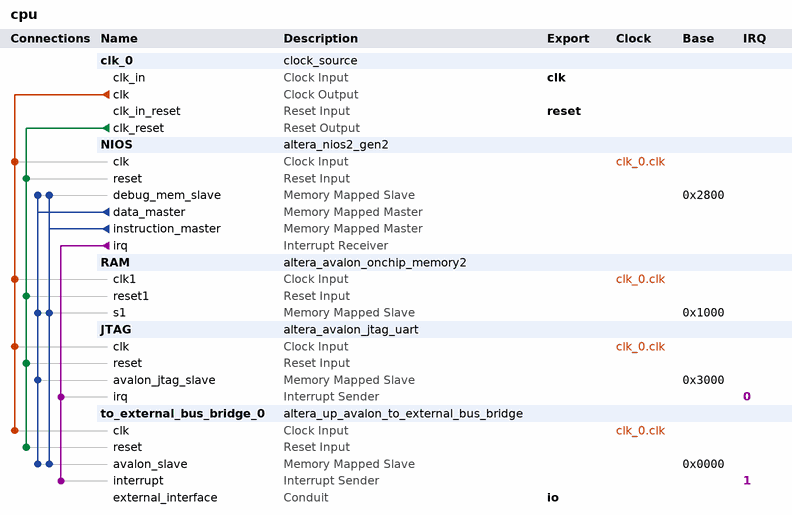
[diagram p0: system contents]
# Platform Designer (Qsys) system cpu, Cyclone V 5CSEMA5F31C6
# Parameters at their usual value, and those the tool derives, are not listed.
package require -exact qsys 18.1
create_system cpu
set_project_property DEVICE_FAMILY {Cyclone V}
set_project_property DEVICE 5CSEMA5F31C6

add_instance clk_0 clock_source 18.1
set_instance_parameter_value clk_0 clockFrequency 50000000

add_instance NIOS altera_nios2_gen2 18.1
set_instance_parameter_value NIOS dcache_size 2048
set_instance_parameter_value NIOS exceptionSlave RAM.s1
set_instance_parameter_value NIOS icache_size 4096
set_instance_parameter_value NIOS impl Fast
set_instance_parameter_value NIOS resetSlave RAM.s1

add_instance RAM altera_avalon_onchip_memory2 18.1
set_instance_parameter_value RAM dataWidth 32
set_instance_parameter_value RAM dualPort false
set_instance_parameter_value RAM initMemContent true
set_instance_parameter_value RAM initializationFileName onchip_mem.hex
set_instance_parameter_value RAM memorySize 4096

add_instance JTAG altera_avalon_jtag_uart 18.1
set_instance_parameter_value JTAG simInteractiveOptions NO_INTERACTIVE_WINDOWS

add_instance to_external_bus_bridge_0 altera_up_avalon_to_external_bus_bridge 18.0
set_instance_parameter_value to_external_bus_bridge_0 addr_size 4
set_instance_parameter_value to_external_bus_bridge_0 addr_size_multiplier Kbytes
set_instance_parameter_value to_external_bus_bridge_0 data_size 16

# connections
add_connection clk_0.clk JTAG.clk clock
add_connection clk_0.clk NIOS.clk clock
add_connection clk_0.clk RAM.clk1 clock
add_connection clk_0.clk to_external_bus_bridge_0.clk clock
add_connection clk_0.clk_reset JTAG.reset reset
add_connection clk_0.clk_reset NIOS.reset reset
add_connection clk_0.clk_reset RAM.reset1 reset
add_connection clk_0.clk_reset to_external_bus_bridge_0.reset reset
add_connection NIOS.data_master JTAG.avalon_jtag_slave avalon
set_connection_parameter_value NIOS.data_master/JTAG.avalon_jtag_slave baseAddress 0x3000
add_connection NIOS.data_master NIOS.debug_mem_slave avalon
set_connection_parameter_value NIOS.data_master/NIOS.debug_mem_slave baseAddress 0x2800
add_connection NIOS.data_master RAM.s1 avalon
set_connection_parameter_value NIOS.data_master/RAM.s1 baseAddress 0x1000
add_connection NIOS.data_master to_external_bus_bridge_0.avalon_slave avalon
set_connection_parameter_value NIOS.data_master/to_external_bus_bridge_0.avalon_slave baseAddress 0x0000
add_connection NIOS.instruction_master NIOS.debug_mem_slave avalon
set_connection_parameter_value NIOS.instruction_master/NIOS.debug_mem_slave baseAddress 0x2800
add_connection NIOS.instruction_master RAM.s1 avalon
set_connection_parameter_value NIOS.instruction_master/RAM.s1 baseAddress 0x1000
add_connection NIOS.instruction_master to_external_bus_bridge_0.avalon_slave avalon
set_connection_parameter_value NIOS.instruction_master/to_external_bus_bridge_0.avalon_slave baseAddress 0x0000
add_connection NIOS.irq JTAG.irq interrupt
set_connection_parameter_value NIOS.irq/JTAG.irq irqNumber 0
add_connection NIOS.irq to_external_bus_bridge_0.interrupt interrupt
set_connection_parameter_value NIOS.irq/to_external_bus_bridge_0.interrupt irqNumber 1

# exported interfaces
add_interface clk clock sink
set_interface_property clk EXPORT_OF clk_0.clk_in
add_interface io conduit end
set_interface_property io EXPORT_OF to_external_bus_bridge_0.external_interface
add_interface reset reset sink
set_interface_property reset EXPORT_OF clk_0.clk_in_reset

set_interconnect_requirement {$system} qsys_mm.clockCrossingAdapter HANDSHAKE
set_interconnect_requirement {$system} qsys_mm.enableEccProtection FALSE
set_interconnect_requirement {$system} qsys_mm.insertDefaultSlave FALSE
set_interconnect_requirement {$system} qsys_mm.maxAdditionalLatency 1

save_system cpu.qsys
